# Altium schematic sheet [6] Charger.SchDoc: Charger
size A3; SheetNumber: 6; SheetTotal: 7
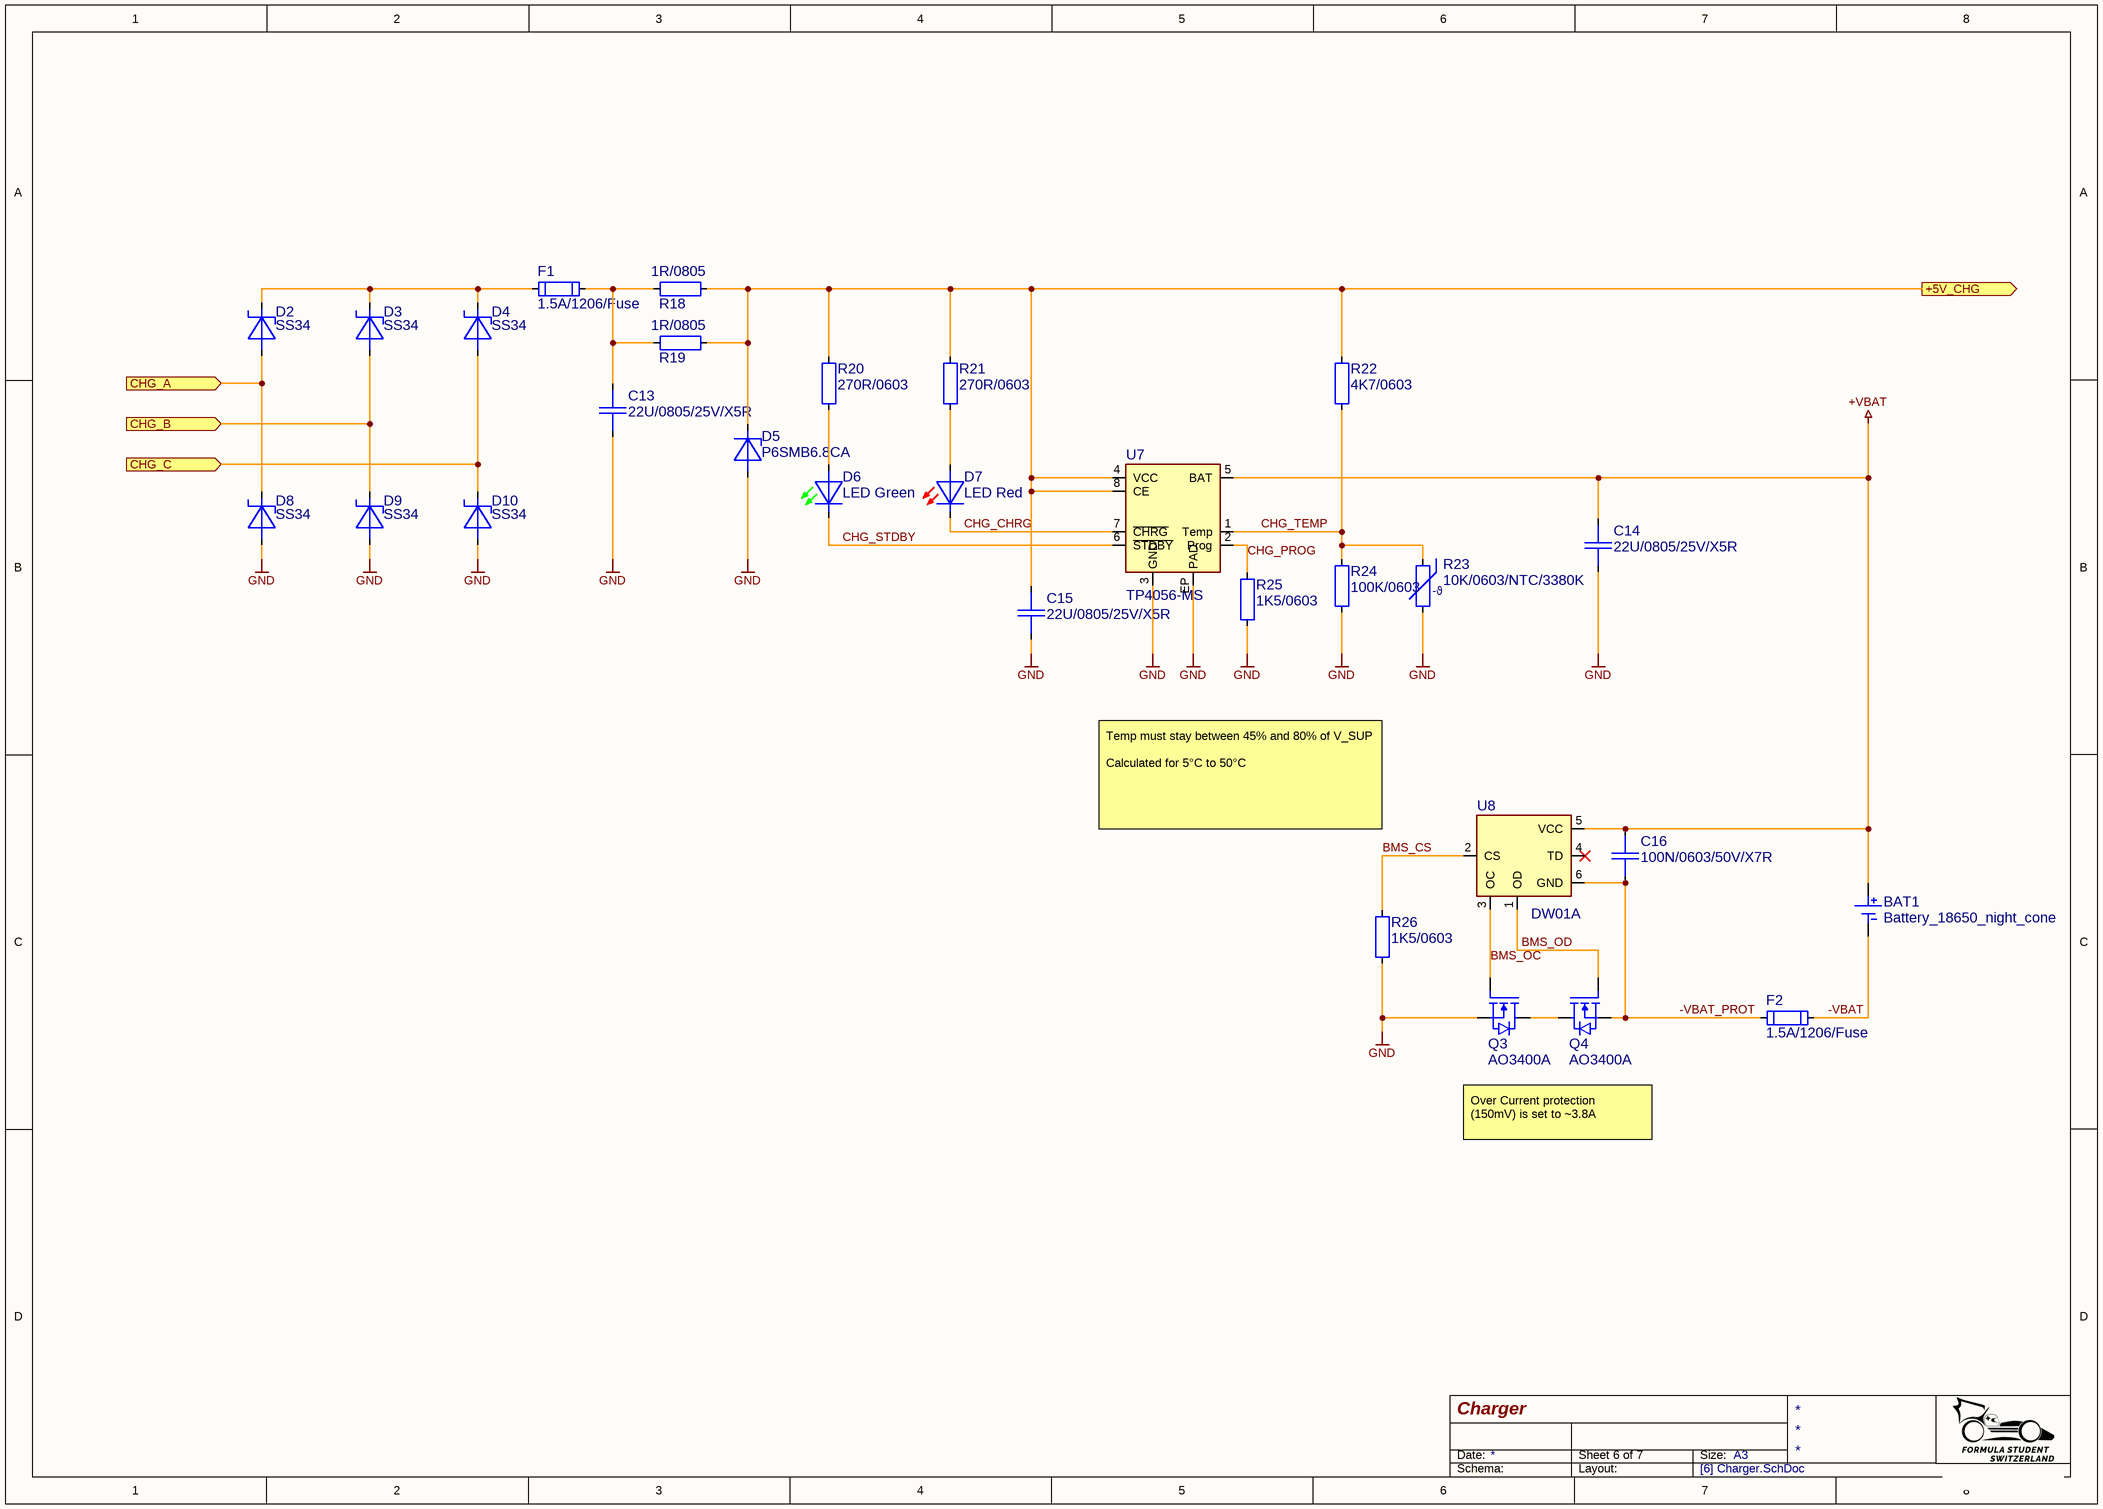
[diagram p0: [6] Charger.SchDoc]

## Parts
BAT1  Battery_18650_night_cone  [Battery_18650_night_cone]
C13  22U/0805/25V/X5R  [CAP0805_X7R]
C14  22U/0805/25V/X5R  [CAP0805_X7R]
C15  22U/0805/25V/X5R  [CAP0805_X7R]
C16  100N/0603/50V/X7R  [CAP0603_X7R]
D2  SS34  [DIOM5226X230]
D3  SS34  [DIOM5226X230]
D4  SS34  [DIOM5226X230]
D5  P6SMB6.8CA  [DIOM5436X265]
D6  LED Green  [LED0805_GREEN]
D7  LED Red  [LED0805_RED]
D8  SS34  [DIOM5226X230]
D9  SS34  [DIOM5226X230]
D10  SS34  [DIOM5226X230]
F1  1.5A/1206/Fuse  [Fuse1206-0.55-WW]
F2  1.5A/1206/Fuse  [Fuse1206-0.55-WW]
Q3  AO3400A  [SOT2395P280X125-3-SE]
Q4  AO3400A  [SOT2395P280X125-3-SE]
R18  1R/0805  [R0805-0.50-WW]
R19  1R/0805  [R0805-0.50-WW]
R20  270R/0603  [R0603-0.40-WW]
R21  270R/0603  [R0603-0.40-WW]
R22  4K7/0603  [R0603-0.40-WW]
R23  10K/0603/NTC/3380K  [R0603-0.40-WW]
R24  100K/0603  [R0603-0.40-WW]
R25  1K5/0603  [R0603-0.40-WW]
R26  1K5/0603  [R0603-0.40-WW]
U7  TP4056-MS  [SOP127P600X155-9-TH330x240-NW]
U8  DW01A  [SOT2395P280X125-6-SW]

## Ports
+5V_CHG (out), CHG_A (in), CHG_B (in), CHG_C (in)

## Nets
+VBAT: BAT1.1(+) C14.1 C16.1 U7.5(BAT) U8.5(VCC)
GND: C13.2 C14.2 C15.2 D5.2 D8.2 D9.2 D10.2 Q3.2(SOURCE) R23.2 R24.2 R25.2 R26.2 U7.3(GND) U7.EP(PAD)
+5V_CHG: C15.1 D5.1 R18.2 R19.2 R20.1 R21.1 R22.1 U7.4(VCC) U7.8(CE) ; port +5V_CHG
-VBAT: BAT1.2(-) F2.1
-VBAT_PROT: C16.2 F2.2 Q4.2(SOURCE) U8.6(GND)
BMS_CS: R26.1 U8.2(CS)
BMS_OC: Q3.1(GATE) U8.3(OC)
BMS_OD: Q4.1(GATE) U8.1(OD)
CHG_A: D2.2 D8.1 ; port CHG_A
CHG_B: D3.2 D9.1 ; port CHG_B
CHG_C: D4.2 D10.1 ; port CHG_C
CHG_CHRG: D7.1 U7.7(~{CHRG})
CHG_PROG: R25.1 U7.2(Prog)
CHG_STDBY: D6.1 U7.6(~{STDBY})
CHG_TEMP: R22.2 R23.1 R24.1 U7.1(Temp)
NetC13_1: C13.1 F1.2 R18.1 R19.1
NetD2_1: D2.1 D3.1 D4.1 F1.1
NetD6_2: D6.2 R20.2
NetD7_2: D7.2 R21.2
NetQ3_3: Q3.3(DRAIN) Q4.3(DRAIN)

Not connected (* = marked no-connect by the designer): U8 4(TD)*

## Notes on the sheet
- Temp must stay between 45% and 80% of V_SUP
  Calculated for 5°C to 50°C
- Over Current protection  (150mV) is set to ~3.8A
- Date:
- Size:
- A3
- Schema:
- Layout:
- (in symbol 10K/0603/NTC/3380K) -ϑ

## Library data of the parts
BAT1 = Battery_18650_night_cone: 18650 Footprint with Hole for 18650 Battery; Manufacturer: NONE; Part Number: Battery_18650_night_cone
C13-C15 = 22U/0805/25V/X5R: CAP SM 0805 22uF 25V X5R; Manufacturer: GENERIC; Absolute Value: 2.2E-5; Part Number: 22U/0805/25V/X5R; Package: 805; Value: 22uF; Manufacturer Part Number 3: CL21A226MAQNNNE; Supplier 3: LCSC; Supplier Part Number 3: C45783; JLC Type: Basic
C16 = 100N/0603/50V/X7R: CAP SM 0603 100nF 50V X7R; Manufacturer: GENERIC; Manufacturer 1: YAGEO; Manufacturer Part Number 1: CC0603KPX7R9BB104; Absolute Value: 1E-7; Part Number: 100N/0603/50V/X7R; Package: 603; Value: 100nF; HelpURL: https://www.yageo.com/upload/media/product/app/datasheet/mlcc/upy-gphc_x7r_6_3v-to-250v.pdf; Supplier 1: Digi-Key; Supplier Part Number 1: 311-3567-1-ND; Manufacturer 2: YAGEO; Manufacturer Part Number 2: CC0603MRX7R9BB104; Supplier 2: Digi-Key; Supplier Part Number 2: 311-4110-1-ND; Manufacturer Part Number 3: CC0603KRX7R9BB104; Supplier 3: LCSC; Supplier Part Number 3: C14663; JLC Type: Basic
D2-D4 D8-D10 = SS34: Si Shottky Diode 3A DO-214AC; Manufacturer: GENERIC; Part Number: SS34; Package: DO-214AC, SMA; HelpURL: https://datasheet.lcsc.com/lcsc/2303141100_MDD-Microdiode-Electronics--SS34_C8678.pdf; Manufacturer 3: MDD; Manufacturer Part Number 3: SS34; Supplier 3: LCSC; Supplier Part Number 3: C8678; JLC Type: Basic
D5 = P6SMB6.8CA: 10.5V 6.45V 5.8V SMB(DO-214AA) TVS; Manufacturer: Littelfuse Inc.; Absolute Value: 6.8V; Part Number: P6SMB6.8CA; Package: DO-214AA; Value: P6SMB6.8CA; HelpURL: https://datasheet.lcsc.com/lcsc/1810181007_Brightking-P6SMB6-8CA-TR13_C78395.pdf; Manufacturer 3: Brightking; Manufacturer Part Number 3: P6SMB6.8CA/TR13; Supplier 3: LCSC; Supplier Part Number 3: C78395; JLC Type: Basic
D6 = LED Green 0805: Generic LED Green 0805; Manufacturer 1: Würth; Manufacturer Part Number 1: 150080GS75000; Part Number: LED Green 0805; Manufacturer: GENERIC; Package: 805; Value: Green; Absolute Value: Green; HelpURL: https://www.we-online.com/katalog/datasheet/150060VS75000.pdf; Supplier 1: Digi-Key; Supplier Part Number 1: 732-4983-1-ND; Manufacturer 3: Hubei KENTO Elec; Manufacturer Part Number 3: KT-0805G; Supplier 3: LCSC; Supplier Part Number 3: C2297; JLC Type: Basic
D7 = LED Red 0805: Generic LED Red 0805; Manufacturer 1: Würth; Manufacturer Part Number 1: 150080RS75000; Part Number: LED Red 0805; Manufacturer: GENERIC; Package: 805; Value: Red; Absolute Value: Red; HelpURL: https://www.we-online.com/katalog/datasheet/150060RS75000.pdf; Supplier 1: Digi-Key; Supplier Part Number 1: 732-4984-1-ND; Manufacturer 3: Foshan NationStar Optoelectronics; Manufacturer Part Number 3: NCD0805R1; Supplier 3: LCSC; Supplier Part Number 3: C84256; JLC Type: Basic
F1 F2 = 1.5A/1206/Fuse: Multifuse 1206 1.5A; Manufacturer: GENERIC; Manufacturer 1: Bourns; Manufacturer Part Number 1: MF-NSMF150-2; Absolute Value: 1.5; Part Number: 1.5A/1206/Fuse; Package: 1206; Value: 1.5A; HelpURL: https://www.bourns.com/docs/product-datasheets/mf-nsmf.pdf?sfvrsn=39c76af6_20; Supplier 1: Digi-Key; Supplier Part Number 1: MF-NSMF150-2CT-ND; Manufacturer 3: Bourns; Manufacturer Part Number 3: MF-NSMF150-2; Supplier 3: LCSC; Supplier Part Number 3: C89655; JLC Type: Extended
Q3 Q4 = AO3400A: 30V N-Channel MOSFET; Manufacturer: Alpha & Omega Semiconductor; Part Number: AO3400A; Package: SOT23; HelpURL: https://aosmd.com/res/data_sheets/AO3400A.pdf; Manufacturer 3: Alpha & Omega Semiconductor; Manufacturer Part Number 3: AO3400A; Supplier 3: LCSC; Supplier Part Number 3: C20917; JLC Type: Basic
R18 R19 = 1R/0805: RES SM 0805 1R; Manufacturer: GENERIC; Manufacturer 1: YAGEO; Manufacturer Part Number 1: RC0805FR-131RL; Absolute Value: 1; Part Number: 1R/0805; Package: 805; Value: 1R; HelpURL: https://www.yageo.com/upload/media/product/productsearch/datasheet/rchip/PYu-RC_Group_51_RoHS_L_12.pdf; Supplier 1: Digi-Key; Supplier Part Number 1: 13-RC0805FR-131RLCT-ND; Manufacturer 2: YAGEO; Manufacturer Part Number 2: RC0805FR-101RL; Supplier 2: Digi-Key; Supplier Part Number 2: 13-RC0805FR-101RLCT-ND; Manufacturer 3: UNI-ROYAL(Uniroyal Elec); Manufacturer Part Number 3: 0805W8F100KT5E; Supplier 3: LCSC; Supplier Part Number 3: C25271; JLC Type: Basic
R20 R21 = 270R/0603: RES SM 0603 270R; Manufacturer: GENERIC; Manufacturer 1: YAGEO; Manufacturer Part Number 1: RC0603FR-13270RL; Absolute Value: 270; Part Number: 270R/0603; Package: 0603; Value: 270R; HelpURL: https://www.yageo.com/upload/media/product/productsearch/datasheet/rchip/PYu-RC_Group_51_RoHS_L_12.pdf; Supplier 1: Digi-Key; Supplier Part Number 1: 13-RC0603FR-13270RLCT-ND; Manufacturer 2: YAGEO; Manufacturer Part Number 2: RC0603FR-10270RL; Supplier 2: Digi-Key; Supplier Part Number 2: 13-RC0603FR-10270RLCT-ND; Manufacturer 3: UNI-ROYAL(Uniroyal Elec); Manufacturer Part Number 3: 0603WAF2700T5E; Supplier 3: LCSC; Supplier Part Number 3: C22966; JLC Type: Basic
R22 = 4K7/0603: RES SM 0603 4K7; Manufacturer: GENERIC; Manufacturer 1: YAGEO; Manufacturer Part Number 1: RC0603FR-134K7L; Absolute Value: 4700; Part Number: 4K7/0603; Package: 0603; Value: 4K7; HelpURL: https://www.yageo.com/upload/media/product/app/datasheet/rchip/pyu-rc_group_51_rohs_l.pdf; Supplier 1: Digi-Key; Supplier Part Number 1: 13-RC0603FR-134K7LCT-ND; Manufacturer 2: YAGEO; Manufacturer Part Number 2: RC0603FR-104K7L; Supplier 2: Digi-Key; Supplier Part Number 2: 13-RC0603FR-104K7LCT-ND; Manufacturer 3: UNI-ROYAL(Uniroyal Elec); Manufacturer Part Number 3: 0603WAF4701T5E; Supplier 3: LCSC; Supplier Part Number 3: C23162; JLC Type: Basic
R23 = 10K/0603/NTC/3380K: RES NTC SM 0603 10K; Manufacturer: GENERIC; Manufacturer 1: Murata; Manufacturer Part Number 1: NCU18XH103E60RB; Absolute Value: 10000; Part Number: 10K/0603/NTC/3380K; Package: 603; Value: 10K; HelpURL: https://www.murata.com/en-us/api/pdfdownloadapi?cate=luNTCforTempeSenso&partno=NCU18XH103E60RB; Supplier 1: Digi-Key; Supplier Part Number 1: 490-18164-1-ND; Manufacturer 3: Sunlord; Manufacturer Part Number 3: SDNT1608X103F3380FTF; Supplier 3: LCSC; Supplier Part Number 3: C316397; JLC Type: Extended
R24 = 100K/0603: RES SM 0603 100K; Manufacturer: GENERIC; Manufacturer 1: YAGEO; Manufacturer Part Number 1: RC0603FR-13100KL; Absolute Value: 100000; Part Number: 100K/0603; Package: 0603; Value: 100K; HelpURL: https://www.yageo.com/upload/media/product/productsearch/datasheet/rchip/PYu-RC_Group_51_RoHS_L_12.pdf; Supplier 1: Digi-Key; Supplier Part Number 1: 13-RC0603FR-13100KLCT-ND; Manufacturer 2: YAGEO; Manufacturer Part Number 2: RC0603FR-10100KL; Supplier 2: Digi-Key; Supplier Part Number 2: 13-RC0603FR-10100KLCT-ND; Manufacturer 3: UNI-ROYAL(Uniroyal Elec); Manufacturer Part Number 3: 0603WAF1003T5E; Supplier 3: LCSC; Supplier Part Number 3: C25803; JLC Type: Basic
R25 R26 = 1K5/0603: RES SM 0603 1K5; Manufacturer: GENERIC; Manufacturer 1: YAGEO; Manufacturer Part Number 1: RC0603FR-131K5L; Absolute Value: 1500; Part Number: 1K5/0603; Package: 0603; Value: 1K5; HelpURL: https://www.yageo.com/upload/media/product/app/datasheet/rchip/pyu-rc_group_51_rohs_l.pdf; Supplier 1: Digi-Key; Supplier Part Number 1: 13-RC0603FR-131K5LCT-ND; Manufacturer 2: YAGEO; Manufacturer Part Number 2: RC0603FR-101K5L; Supplier 2: Digi-Key; Supplier Part Number 2: 13-RC0603FR-101K5LCT-ND; Manufacturer 3: UNI-ROYAL(Uniroyal Elec); Manufacturer Part Number 3: 0603WAF1501T5E; Supplier 3: LCSC; Supplier Part Number 3: C22843; JLC Type: Basic
U7 = TP4056-MS: 1A Standalone Linear Li-lon Battery Charger with Thermal Regulation in SOP-8; Manufacturer: MSKSEMI; Part Number: TP4056-MS; Package: SOP-8; HelpURL: https://datasheet.lcsc.com/lcsc/2308080947_MSKSEMI-TP4056-MS_C7473158.pdf; Manufacturer 3: MSKSEMI; Manufacturer Part Number 3: TP4056-MS; Supplier 3: LCSC; Supplier Part Number 3: C7473158; JLC Type: Extended
U8 = DW01A: Single Cell Lithium-ion battery protection IC; Manufacturer: PUOLOP; Part Number: DW01A; Package: SOT23-6; HelpURL: https://datasheet.lcsc.com/lcsc/1912111437_PUOLOP-DW01A_C351410.pdf; Manufacturer 3: PUOLOP; Manufacturer Part Number 3: DW01A; Supplier 3: LCSC; Supplier Part Number 3: C351410; JLC Type: Extended